# EAGLE design SleepSureStandAloneV2 (EAGLE 9.6.2)
COMPANY: ADAFRUIT INDUSTRIES; DRAWN: KTOWN; REV: B
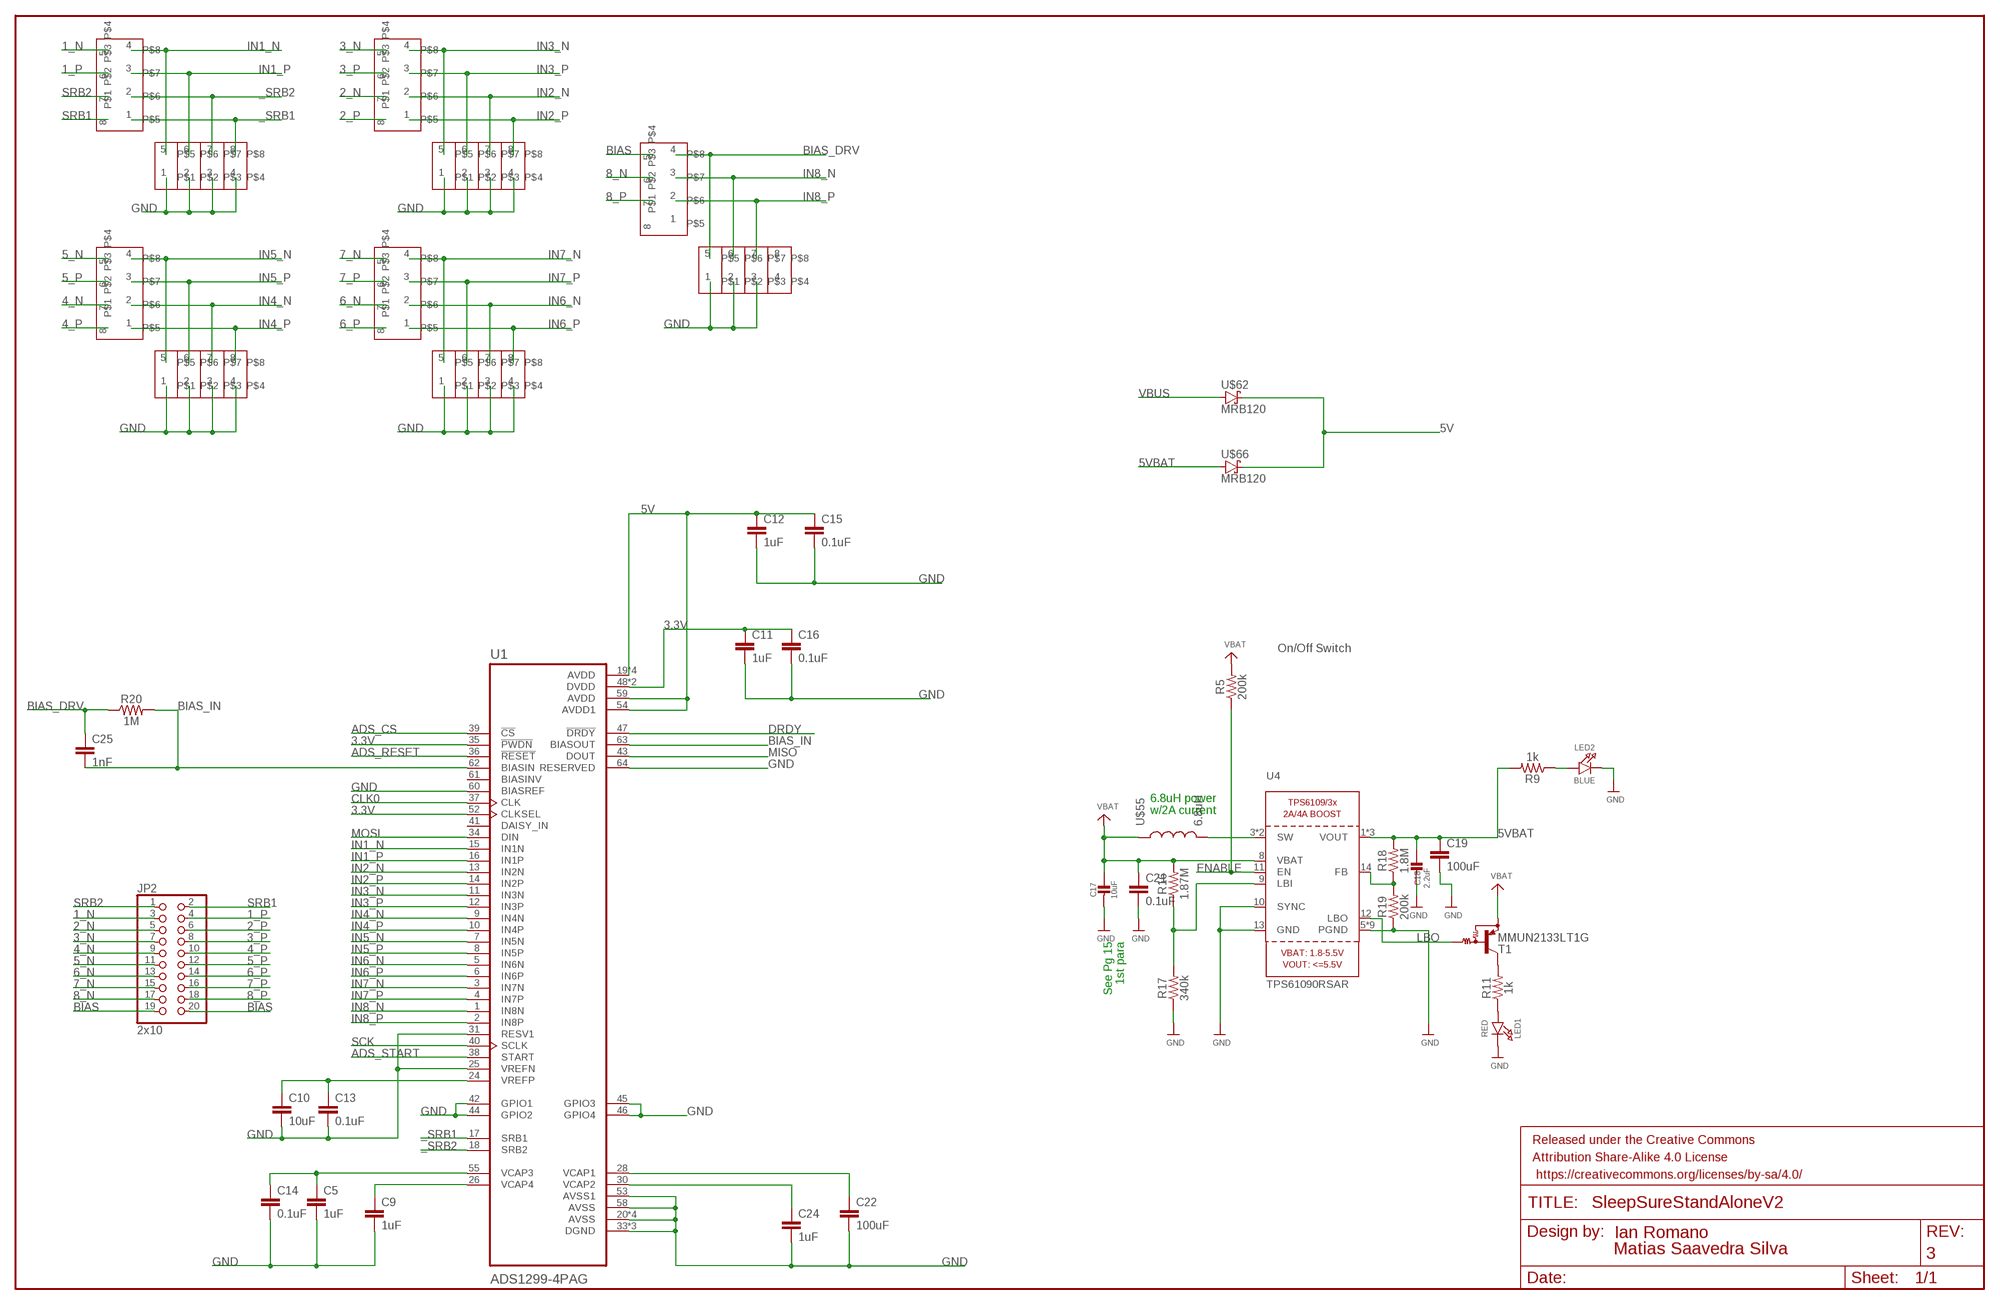
[diagram p0: schematic, sheet 1, part 1 of 2]
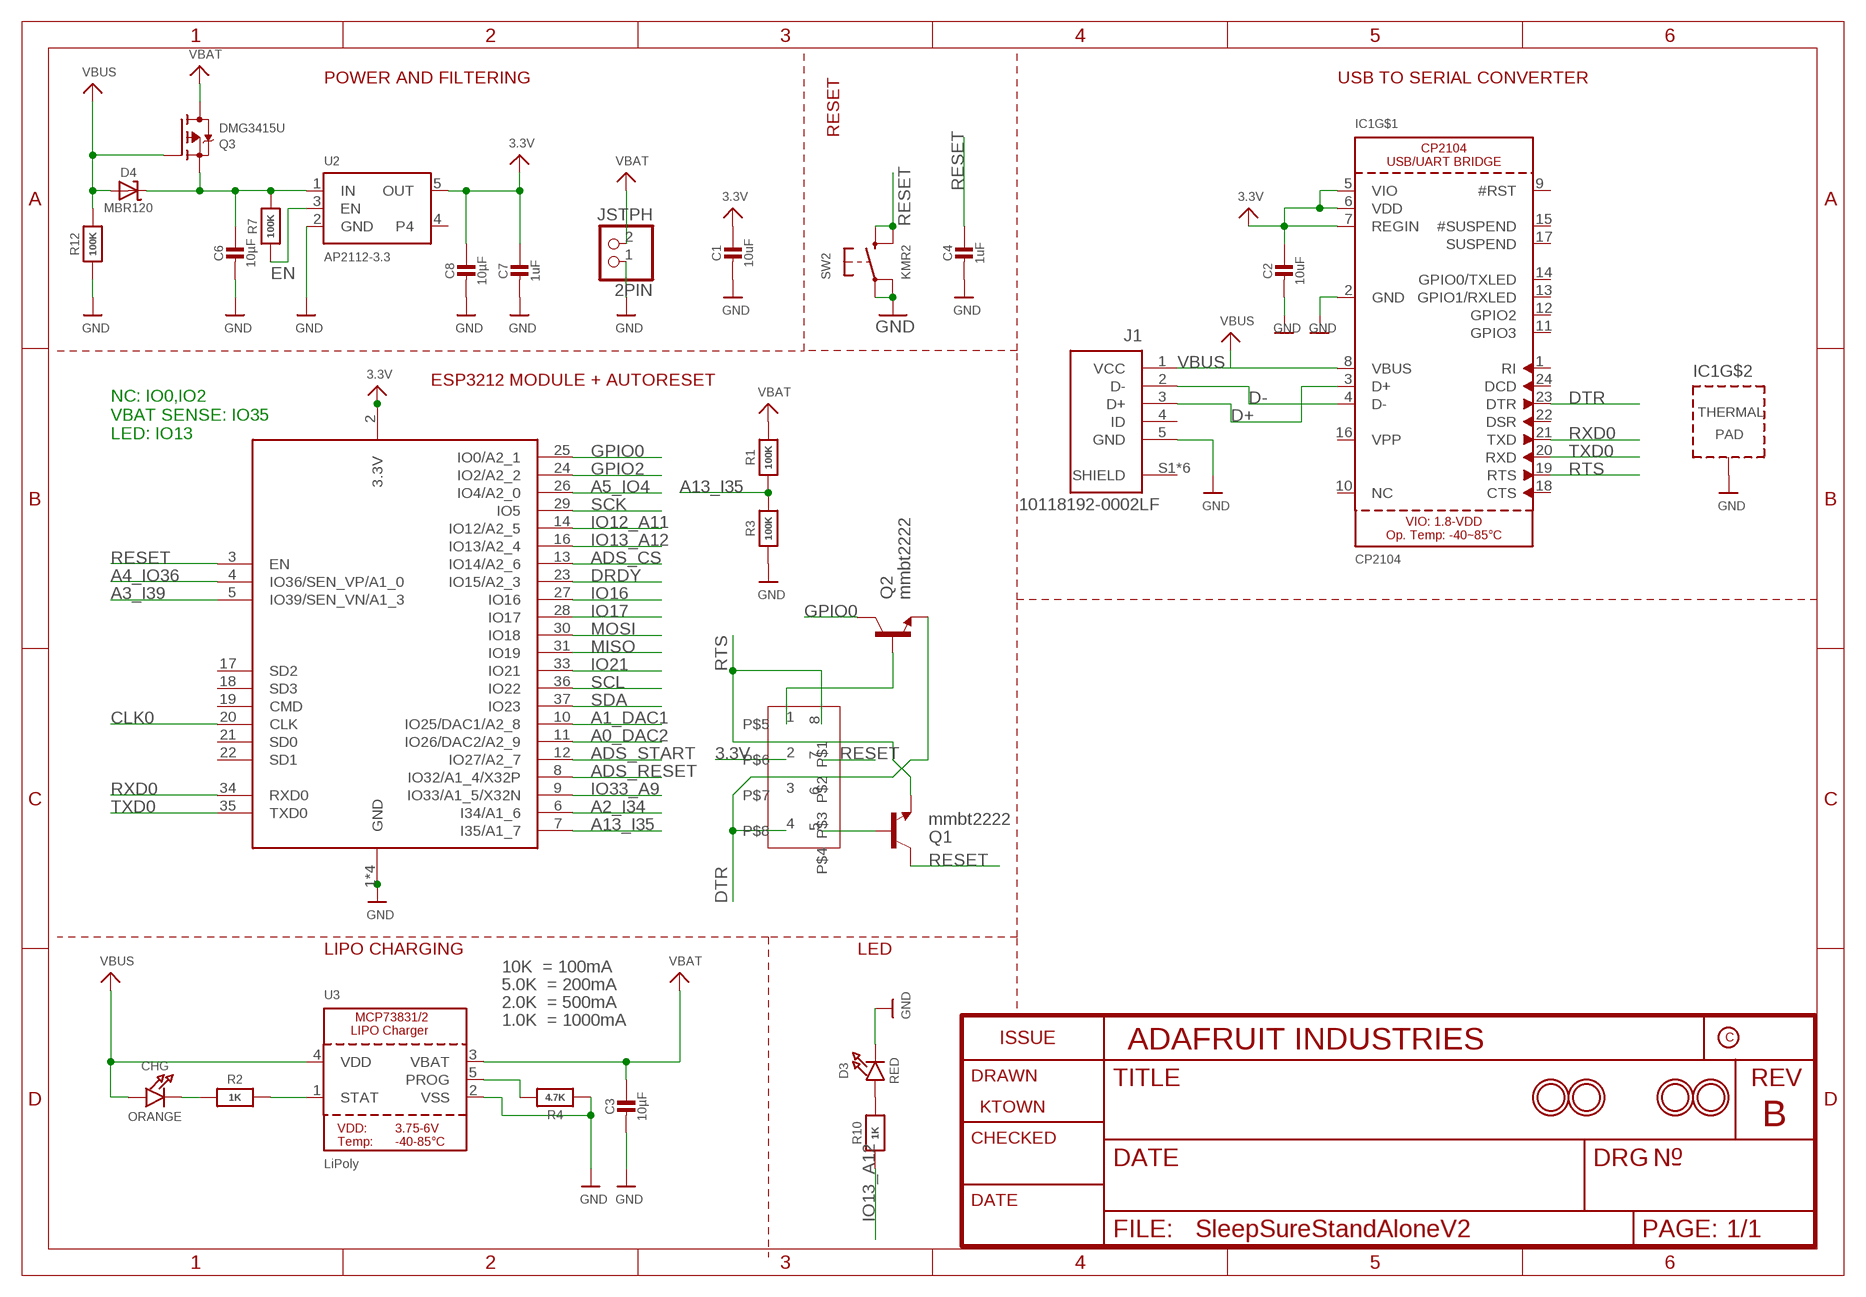
[diagram p1: schematic, sheet 1, part 2 of 2]

## Parts
2PIN  JSTPH  CON_JST_PH_2PIN  [JSTPH2]
C1  10uF  CAP_CERAMIC0805-NOOUTLINE  [0805-NO]
C2  10uF  CAP_CERAMIC0805-NOOUTLINE  [0805-NO]
C3  10µF  CAP_CERAMIC0805-NOOUTLINE  [0805-NO]
C4  1uF  CAP_CERAMIC0603_NO  [0603-NO]
C5  1uF  10UF-0805-10V-10%  [0805]
C6  10µF  CAP_CERAMIC0805-NOOUTLINE  [0805-NO]
C7  1uF  CAP_CERAMIC0603_NO  [0603-NO]
C8  10µF  CAP_CERAMIC0805-NOOUTLINE  [0805-NO]
C9  1uF  10UF-0805-10V-10%  [0805]
C10  10uF  10UF-0805-10V-10%  [0805]
C11  1uF  10UF-0805-10V-10%  [0805]
C12  1uF  10UF-0805-10V-10%  [0805]
C13  0.1uF  10UF-0805-10V-10%  [0805]
C14  0.1uF  10UF-0805-10V-10%  [0805]
C15  0.1uF  10UF-0805-10V-10%  [0805]
C16  0.1uF  10UF-0805-10V-10%  [0805]
C17  10uF  CAP_CERAMIC0805-NOOUTLINE  [0805-NO]
C18  2.2uF  CAP_CERAMIC0805-NOOUTLINE  [0805-NO]
C19  100uF  10UF-1206-6.3V-20%  [1206]
C21  0.1uF  10UF-0805-10V-10%  [0805]
C22  100uF  10UF-1206-6.3V-20%  [1206]
C24  1uF  10UF-0805-10V-10%  [0805]
C25  1nF  10UF-0805-10V-10%  [0805]
CHG  ORANGE  LED0805_NOOUTLINE  [CHIPLED_0805_NOOUTLINE]
D3  RED  LED0805_NOOUTLINE  [CHIPLED_0805_NOOUTLINE]
D4  MBR120  DIODE-SCHOTTKYSOD-123  [SOD-123]
FRAME2  FRAME-LEDGER  [CREATIVE_COMMONS]
IC1  CP2104  [QFN24_4MM_SMSC]
J1  10118192-0002LF  [AMPHENOL_10118192-0002LF]
JP2  2x10  PINHD-2X10-BIG  [2X09-BIG]
LED1  RED  LED0805_NOOUTLINE  [CHIPLED_0805_NOOUTLINE]
LED2  BLUE  LED0805_NOOUTLINE  [CHIPLED_0805_NOOUTLINE]
Q1  mmbt2222  TRANSISTOR_NPNSOT23-3  [SOT23-3]
Q2  mmbt2222  TRANSISTOR_NPNSOT23-3  [SOT23-3]
Q3  DMG3415U  MOSFET-P  [SOT23-R]
R1  100K  RESISTOR_0603_NOOUT  [0603-NO]
R2  1K  RESISTOR_0603_NOOUT  [0603-NO]
R3  100K  RESISTOR_0603_NOOUT  [0603-NO]
R4  4.7K  RESISTOR_0603_NOOUT  [0603-NO]
R5  200k  RESISTOR0805  [0805]
R7  100K  RESISTOR_0603_NOOUT  [0603-NO]
R9  1k  RESISTOR0805  [0805]
R10  1K  RESISTOR_0603_NOOUT  [0603-NO]
R11  1k  RESISTOR0805  [0805]
R12  100K  RESISTOR_0603_NOOUT  [0603-NO]
R16  1.87M  RESISTOR0805  [0805]
R17  340k  RESISTOR0805  [0805]
R18  1.8M  RESISTOR0805  [0805]
R19  200k  RESISTOR0805  [0805]
R20  1M  RESISTOR0805  [0805]
SW2  KMR2  SWITCH_TACT_SMT4.6X2.8  [BTN_KMR2_4.6X2.8]
T1  MMUN2133LT1G  MUN2114T1-PNP_DRIVER-SC59-BEC  [SC59-BEC]
U1  ADS1299-4PAG  [QFP50P1200X1200X120-64N]
U2  AP2112-3.3  VREG_SOT23-5  [SOT23-5]
U3  LiPoly  MCP73831/2  [SOT23-5]
U4  TPS61090RSAR  VREG_TPS6103X  [PVQFN-16]
U$6  MOUNTINGHOLE2.5  [MOUNTINGHOLE_2.5_PLATED]
U$7  10k  EXB-28V222JX  [RESCAXS50P200X100X45-8N]
U$19  MOUNTINGHOLE2.5  [MOUNTINGHOLE_2.5_PLATED]
U$23  1nF  W2A45C103MAT2A  [CAPCAXE50P210X130X94-8N]
U$31  MOUNTINGHOLE2.5  [MOUNTINGHOLE_2.5_PLATED]
U$32  MOUNTINGHOLE2.5  [MOUNTINGHOLE_2.5_PLATED]
U$44  2.2k  EXB-28V222JX  [RESCAXS50P200X100X45-8N]
U$45  2.2k  EXB-28V222JX  [RESCAXS50P200X100X45-8N]
U$46  1nF  W2A45C103MAT2A  [CAPCAXE50P210X130X94-8N]
U$47  2.2k  EXB-28V222JX  [RESCAXS50P200X100X45-8N]
U$48  1nF  W2A45C103MAT2A  [CAPCAXE50P210X130X94-8N]
U$49  2.2k  EXB-28V222JX  [RESCAXS50P200X100X45-8N]
U$50  1nF  W2A45C103MAT2A  [CAPCAXE50P210X130X94-8N]
U$51  2.2k  EXB-28V222JX  [RESCAXS50P200X100X45-8N]
U$52  1nF  W2A45C103MAT2A  [CAPCAXE50P210X130X94-8N]
U$55  6.8uH  ASPI-0628-6R8M-T1  [0628]
U$62  MRB120  MBR160HW  [SOD123FL]
U$66  MRB120  MBR160HW  [SOD123FL]
X2  ESP32_WROOM32_SKINNY  [WROOM32_SKINNY]

## Nets
1_N [DiffPairs]: JP2.3 U$44.5
1_P [DiffPairs]: JP2.4 U$44.6
2_N [DiffPairs]: JP2.5 U$45.7
2_P [DiffPairs]: JP2.6 U$45.8
3.3V [PWR]: C1.1 C2.1 C7.1 C8.1 C11.1 C16.1 IC1.5(VIO) IC1.6(VDD) IC1.7(REGIN) U1.35(!PWDN) U1.48(DVDD) U1.50(DVDD) U1.52(CLKSEL) U2.5(OUT) U$7.2 X2.2(3.3V)
3_N [DiffPairs]: JP2.7 U$45.5
3_P [DiffPairs]: JP2.8 U$45.6
4_N [DiffPairs]: JP2.9 U$47.7
4_P [DiffPairs]: JP2.10 U$47.8
5_N: JP2.11 U$47.5
5_P: JP2.12 U$47.6
5V: C12.1 C15.1 U1.19(AVDD) U1.21(AVDD) U1.22(AVDD) U1.54(AVDD1) U1.56(AVDD) U1.59(AVDD) U$62.C U$66.C
5VBAT: C18.1 C19.1 R9.2 R18.2 U4.1(VOUT) U4.15(VOUT) U4.16(VOUT) U$66.A
6_N: JP2.13 U$49.7
6_P: JP2.14 U$49.8
7_N: JP2.15 U$49.5
7_P: JP2.16 U$49.6
8_N [PWR]: JP2.17 U$51.6
8_P [PWR]: JP2.18 U$51.7
_SRB1: U1.17(SRB1) U$23.8 U$44.1
_SRB2: U1.18(SRB2) U$23.7 U$44.2
A0_DAC2: X2.11(IO26/DAC2/A2_9)
A1_DAC1: X2.10(IO25/DAC1/A2_8)
A2_I34: X2.6(I34/A1_6)
A3_I39: X2.5(IO39/SEN_VN/A1_3)
A4_IO36: X2.4(IO36/SEN_VP/A1_0)
A5_IO4: X2.26(IO4/A2_0)
A13_I35: R1.1 R3.2 X2.7(I35/A1_7)
ADS_CS: U1.39(!CS) X2.13(IO14/A2_6)
ADS_RESET: U1.36(!RESET) X2.8(IO32/A1_4/X32P)
ADS_START: U1.38(START) X2.12(IO27/A2_7)
BIAS: JP2.19 JP2.20 U$51.5
BIAS_DRV: C25.1 R20.1 U$51.4 U$52.5
BIAS_IN: C25.2 R20.2 U1.62(BIASIN) U1.63(BIASOUT)
CLK0: U1.37(CLK) X2.20(CLK)
D+: IC1.3(D+) J1.3(D+)
D-: IC1.4(D-) J1.2(D-)
DRDY: U1.47(!DRDY) X2.23(IO15/A2_3)
DTR: IC1.23(DTR) Q2.2(E) U$7.4
EN: R7.1 U2.3(EN)
ENABLE: R5.1 U4.11(EN)
GND [PWR]: 2PIN.1 C1.2 C2.2 C3.2 C4.2 C5.2 C6.2 C7.2 C8.2 C9.2 C10.2 C11.2 C12.2 C13.2 C14.2 C15.2 C16.2 C17.2 C18.2 C19.2 C21.2 C22.2 C24.2 D3.C IC1.2(GND) IC1.THERM(TP) J1.5(GND) LED1.C LED2.C R3.1 R4.1 R12.1 R17.1 R19.1 SW2.A'(P1) SW2.A(P) U1.20(AVSS) U1.23(AVSS) U1.25(VREFN) U1.31(RESV1) U1.32(AVSS) U1.33(DGND) U1.42(GPIO1) U1.44(GPIO2) U1.45(GPIO3) U1.46(GPIO4) U1.49(DGND) U1.51(DGND) U1.53(AVSS1) U1.57(AVSS) U1.58(AVSS) U1.60(BIASREF) U1.64(RESERVED) U2.2(GND) U3.2(VSS) U4.5(PGND) U4.6(PGND) U4.7(PGND) U4.10(SYNC) U4.13(GND) U4.P$18(PGND) U4.P$19(PGND) U4.P$20(PGND) U4.P$21(PGND) U4.P$22(PGND) U4.THERMAL(PGND) U$23.1 U$23.2 U$23.3 U$23.4 U$46.1 U$46.2 U$46.3 U$46.4 U$48.1 U$48.2 U$48.3 U$48.4 U$50.1 U$50.2 U$50.3 U$50.4 U$52.1 U$52.2 U$52.3 X2.1(GND) X2.15(GND) X2.38(GND) X2.P$1(GND)
GPIO0: Q2.3(C) X2.25(IO0/A2_1)
GPIO2: X2.24(IO2/A2_2)
IN1_N [DiffPairs]: U1.15(IN1N) U$23.5 U$44.4
IN1_P [DiffPairs]: U1.16(IN1P) U$23.6 U$44.3
IN2_N [DiffPairs]: U1.13(IN2N) U$45.2 U$46.7
IN2_P [DiffPairs]: U1.14(IN2P) U$45.1 U$46.8
IN3_N [DiffPairs]: U1.11(IN3N) U$45.4 U$46.5
IN3_P [DiffPairs]: U1.12(IN3P) U$45.3 U$46.6
IN4_N [DiffPairs]: U1.9(IN4N) U$47.2 U$48.7
IN4_P [DiffPairs]: U1.10(IN4P) U$47.1 U$48.8
IN5_N [PWR]: U1.7(IN5N) U$47.4 U$48.5
IN5_P [PWR]: U1.8(IN5P) U$47.3 U$48.6
IN6_N [PWR]: U1.5(IN6N) U$49.2 U$50.7
IN6_P [PWR]: U1.6(IN6P) U$49.1 U$50.8
IN7_N [PWR]: U1.3(IN7N) U$49.4 U$50.5
IN7_P [PWR]: U1.4(IN7P) U$49.3 U$50.6
IN8_N [PWR]: U1.1(IN8N) U$51.3 U$52.6
IN8_P [PWR]: U1.2(IN8P) U$51.2 U$52.7
IO12_A11: X2.14(IO12/A2_5)
IO13_A12: R10.1 X2.16(IO13/A2_4)
IO16: X2.27(IO16)
IO17: X2.28(IO17)
IO21: X2.33(IO21)
IO33_A9: X2.9(IO33/A1_5/X32N)
LBO: T1.B U4.12(LBO)
MISO: U1.43(DOUT) X2.31(IO19)
MOSI: U1.34(DIN) X2.30(IO18)
N$1: CHG.C R2.1
N$2: Q2.1(B) U$7.1
N$3: R2.2 U3.1(STAT)
N$4: R4.2 U3.5(PROG)
N$5: D3.A R10.2
N$6: Q1.1(B) U$7.5
N$7: C6.1 D4.C Q3.2(S) R7.2 U2.1(IN)
N$8: C24.1 U1.30(VCAP2)
N$9: C22.1 U1.28(VCAP1)
N$10: C10.1 C13.1 U1.24(VREFP)
N$11: C5.1 C14.1 U1.55(VCAP3)
N$14: C9.1 U1.26(VCAP4)
N$16: U4.3(SW) U4.4(SW) U$55.P$2
N$17: R16.1 R17.2 U4.9(LBI)
N$18: R18.1 R19.2 U4.14(FB)
N$19: LED2.A R9.1
N$20: LED1.A R11.1
N$21: R11.2 T1.C
RESET: C4.1 Q1.3(C) SW2.B'(S1) SW2.B(S) U$7.7 X2.3(EN)
RTS: IC1.19(RTS) Q1.2(E) U$7.8
RXD0: IC1.21(TXD) X2.34(RXD0)
SCK: U1.40(SCLK) X2.29(IO5)
SCL: X2.36(IO22)
SDA: X2.37(IO23)
SRB1: JP2.2 U$44.8
SRB2: JP2.1 U$44.7
TXD0: IC1.20(RXD) X2.35(TXD0)
VBAT: 2PIN.2 C3.1 C17.1 C21.1 Q3.3(D) R1.2 R5.2 R16.2 T1.E U3.3(VBAT) U4.8(VBAT) U$55.P$1
VBUS: CHG.A D4.A IC1.8(VBUS) J1.1(VCC) Q3.1(G) R12.2 U3.4(VDD) U$62.A
Unconnected: IC1.1(RI) IC1.9(#RST) IC1.10(NC) IC1.11(GPIO3) IC1.12(GPIO2) IC1.13(GPIO1/RXLED) IC1.14(GPIO0/TXLED) IC1.15(#SUSPEND) IC1.16(VPP) IC1.17(SUSPEND) IC1.18(CTS) IC1.22(DSR) IC1.24(DCD) J1.4(ID) J1.S1(SHIELD) J1.S2(SHIELD) J1.S3(SHIELD) J1.S4(SHIELD) J1.S5(SHIELD) J1.S6(SHIELD) U1.41(DAISY_IN) U1.61(BIASINV) U2.4 U$7.3 U$7.6 U$51.1 U$51.8 U$52.4 U$52.8 X2.17(SD2) X2.18(SD3) X2.19(CMD) X2.21(SD0) X2.22(SD1)

## Notes on the sheet
- POWER AND FILTERING | USB TO SERIAL CONVERTER
- RESET
- On/Off Switch
- ESP3212 MODULE + AUTORESET
- NC: IO0,IO2
  VBAT SENSE: IO35
  LED: IO13
- 6.8uH power
  w/2A current
- See Pg 15
  1st para
- LIPO CHARGING | LED
- 10K  = 100mA
- 5.0K  = 200mA
- 2.0K  = 500mA
- 1.0K  = 1000mA

## Library data of the parts
2PIN = microbuilder:CON_JST_PH_2PIN: JST 2-Pin Right-Angle Connector PH-Series - 4UConnector: 17311 SH-Series - 4UConnector: 07278
C1-C4 C6-C8 C17 C18 = microbuilder:CAP_CERAMIC: Ceramic Capacitors For new designs, use the packages preceded by an '_' character since they are more reliable: The following footprints should be used on most boards: _0402 - Standard footprint for regular board layouts _0603 - Standard footprint for regular board layouts _0805 - Standard footprint for regular board layouts _1206 - Standard footprint for regular board layouts For extremely tight-pitch boards where space is at a premium, the following 'micro-pitch' footprints can be used (smaller pads, no silkscreen outline, etc.): _0402MP - Micro-pitch footprint for very dense/compact boards _0603MP - Micro-pitch footprint for very dense/compact boards _0805MP - Micro-pitch footprint for very dense/compact boards _1206MP - Micro-pitch footprint for very dense/compact boards
C5 C9 C11-C16 C21 C24 C25 = SparkFun-Capacitors:10UF: 10.0µF ceramic capacitors A capacitor is a passive two-terminal electrical component used to store electrical energy temporarily in an electric field.; PROD_ID: CAP-11330; VALUE: 10uF
C10 = SparkFun-Capacitors:10UF: 10.0µF ceramic capacitors A capacitor is a passive two-terminal electrical component used to store electrical energy temporarily in an electric field.; PROD_ID: CAP-11330
C19 C22 = SparkFun-Capacitors:10UF: 10.0µF ceramic capacitors A capacitor is a passive two-terminal electrical component used to store electrical energy temporarily in an electric field.; PROD_ID: CAP-10057; VALUE: 10uF
CHG D3 LED1 LED2 = microbuilder:LED: LED 0603 - 0603 Surface Mount Package 2mA: Green LED - Low Power (3.9mcd, 2ma, 1.7Vf) - Digikey: 475-2709-2-ND Orange LED - Low Power (9.8mcd, 2ma, 1.8Vf) - Digikey: 475-1194-2-ND Red LED - Low Power (5mcd, 2ma, 1.8Vf) - Digikey: 475-1195-2-ND Yellow LED - Low Power (7mcd, 2ma, 1.8Vf) - Digikey: 475-1196-2-ND 5mA: Blue LED - Low Power (17mcd, 5ma, 2.9Vf) - Digikey: LNJ937W8CRACT-ND 0805 - 0805 Surface Mount Package 2mA: Red LED (8.8mcd, 2mA, 1.8Vf, Clear) - Low Power [Digikey: 475-2510-1-ND] Green LED (5mcd, 2mA, 1.8Vf, Clear) - Low Power [Digikey: 475-2730-1-ND] Yellow LED (11.3mcd, 2mA, 1.8Vf, Clear) - Low Power [Digikey: 475-2555-1-ND] 20mA: Red LED (104mcd, 20mA, Diffused) - LS R976 [Digikey: 475-1278-6-ND] Red LED (12mcd, 20mA, 2.0Vf, Clear) - APT2012EC [Digikey: 754-1128-1-ND] Green LED (15mcd, 20mA, 2.2Vf, Clear) - APT2012GC [Digikey: 754-1131-1-ND] Orange LED (160mcd, 20mA, 2.1Vf, Clear) - APT2012SECK [Digikey: 754-1130-1-ND] 1206 - 1206 Surface Mount Package Green LED (26mcd, 20mA, Diffused) - LG N971 [Digikey: 475-1407-6-ND] Red LED (15mcd, 20mA, Diffused) - LH N974 [Digikey: 475-1416-6-ND] Cree - Cree High-Power Surface Mount LEDs XPEBWT-L1-0000-00D50 - White 111lm 350mA 2.9Vf 6200K 110° XTEAWT-00-0000-00000LEE3 - White 114lm 350mA 2.85Vf 5000K 115° Everlight - Everlight 45-21 Series Surface Mount LEDs 45-21/QK2C-B2832AC2CB2/2T - Warm White 2000mcd 20mA 3.25Vf 3050K 120° 45-21/LK2C-B38452C4CB2/2T - Nuetral White 2000mcd 20mA 3.25Vf 4150K 120° 45-21/LK2C-B50634C6CB2/2T - Cold White 2200mcd 20mA 3.25Vf 5650K 120° PLCC2 Reverse Mount LS T77K-J1L2-1-0-2-R18-Z - Red 11.25mcd 2mA 1.8Vf 630nm 120° LO T77K-L1M2-24-Z - Orange 19.6mcd 2mA 1.8Vf 606nm 120° LY T77K-K2M1-26-Z - Yellow 15.7mcd 2mA 1.8Vf 587nm 120°
D4 = microbuilder:DIODE-SCHOTTKY
FRAME2 = SparkFun-Aesthetics:FRAME-LEDGER: Schematic Frame - Ledger Standard 11x14 US Ledger frame; DESIGNER: Ian Romano; DESIGNER2: Matias Saavedra Silva; REV: 3
IC1 = microbuilder:CP2104: CP2104 - USB to UART Bridge VDD Output: 3.45V
J1 = ADS_Feather:10118192-0002LF: USB - micro B USB 2.0 Receptacle Connector 5 Position Surface Mount, Right Angle Check prices <https://pricing.snapeda.com/parts/10118192-0002LF/Amphenol%20ICC%20%28FCI%29/view-part?ref=eda>; AVAILABILITY: Good; DESCRIPTION: USB - micro B USB 2.0 Receptacle Connector 5 Position Surface Mount, Right Angle; MF: Amphenol ICC (FCI); MP: 10118192-0002LF; PACKAGE: None; PRICE: None; PURCHASE-URL: https://pricing.snapeda.com/search/part/10118192-0002LF/?ref=eda
JP2 = SleepSureLib:PINHD-2X10: PIN HEADER With larger annulars
Q1 Q2 = SparkFun:TRANSISTOR_NPN: Transistor NPN BJT configuration in SOT23 package. MMBT2222 is the common NPN we use. Double check BCE configuration again layout.
Q3 = microbuilder:MOSFET-P: P-Channel Mosfet LEGEND VDS: Voltage Drain-Source ID: Drain Current RDS(ON): Drain-Source On-State Resistance VGS(TH): Gate-Source Threshold Voltage CISS: Drain-Source Input Capacitance SOT-23 Name VDS ID RDS(ON) VGS(TH) CISS Order Number IRLML5103 30V 760mA 600 mOhm -- 75pF @ 25V Digikey: IRLML5103PBFCT-ND IRLML6401 12V 4.3A 50 mOhm 950mV @ 250µA 830pF @ 10V Digikey: IRLML6401PBFTR-ND NTR0202PL 20V 400mA 800 mOhm 2.3V @ 250uA 70pF @ 5V Digikey: NTR0202PLT1GOSTR-ND NTR4101PT1G 20V 1.8A 85 mOhm 1.2V @ 250uA 675pF @ 10V Digikey: NTR4101PT1GOSCT-ND DMP2004K 20V 600mA 900 mOhm 1V @ 250uA 175pF @ 16V Digikey: DMP2004KDICT-ND PMV65XP 20V 3.9A 76 mOhm 950mV @ 1mA 725pF @ 20V Digikey: 568-2358-2-ND TO-252 Name VDS ID RDS(ON) VGS(TH) CISS Order Number AOD417 30V 25A 34 mOhm 3V @ 250µA 920pF @ 15V Digikey: 785-1106-2-ND PowerPak Name VDS ID RDS(ON) VGS(TH) CISS Order Number AON7401 30V 12A 14 mOhm 3V @ 250µA 2600pF @ 15V Digikey: 785-1302-1-ND
R1-R4 R7 R10 R12 = microbuilder:RESISTOR: Resistors For new designs, use the packages preceded by an '_' character since they are more reliable: The following footprints should be used on most boards: _0402 - Standard footprint for regular board layouts _0603 - Standard footprint for regular board layouts _0805 - Standard footprint for regular board layouts _1206 - Standard footprint for regular board layouts For extremely tight-pitch boards where space is at a premium, the following 'micro-pitch' footprints can be used (smaller pads, no silkscreen outline, etc.): _0402MP - Micro-pitch footprint for very dense/compact boards _0603MP - Micro-pitch footprint for very dense/compact boards _0805MP - Micro-pitch footprint for very dense/compact boards _1206MP - Micro-pitch footprint for very dense/compact boards
R5 R9 R11 R16-R20 = SparkFun-Resistors:RESISTOR: Generic Resistor Package
SW2 = microbuilder:SWITCH_TACT_SMT: SMT Tact Switches 6x6mm - Digikey: P12940SCT-ND KMR2 (4.6x2.8mm) - Digikey: 401-1426-1-ND EVQ-PQHB55 - Light Touch, 160GF (4.5x4.5mm) - Digikey: P8090SCT-ND KMT0 - KMT021 NGJ LHS (etc.) IP68/Waterproof - Digikey: CKN10289CT-ND
T1 = transistor:*-PNP_DRIVER-: PNP Bias Resistor Transistor
U1 = ADS1299-4PAG:ADS1299-4PAG: Check prices <https://pricing.snapeda.com/search/part/ADS1299-4PAG/?ref=eda>; AVAILABILITY: Warning; DESCRIPTION: Low-Noise, 4-Channel, 24-Bit Analog-to-Digital Converter for Biopotential Measurements 64-TQFP -40 to 85; MF: Texas Instruments; MP: ADS1299-4PAG; PACKAGE: TQFP-64 Texas Instruments; PRICE: None; PURCHASE-URL: https://pricing.snapeda.com/search/part/ADS1299-4PAG/?ref=eda
U2 = microbuilder:VREG_SOT23-5: SOT23-5 Fixed Voltage Regulators Part Current Out V Out V In V Dropout θJA (°C/W) TJ (°C) Digikey Part No. ADP121 150mA 3.3V 3.4-5.5V 0.09V @ 150mA -- -- ADP121-AUJZ33R7CT-ND ADP121 150mA 3.0V 3.1-5.5V 0.09V @ 150mA -- -- ADP121-AUJZ30R7CT-ND ADP122 300mA 3.3V 3.4-5.5V 0.085V @ 300mA -- -- ADP122AUJZ-3.3-R7CT-ND ADP1712 300mA 3.3V 3.5-5.5V 0.17V @ 300mA -- -- ADP1712AUJZ-3.3-R7TR-ND AP7311 (Low Cost) 150mA 3.3V 3.5-6V 0.15V @ 150mA -- -- AP7311-33WG-7DICT-ND LD39015M18R 150mA 1.8V 1.9V-5.5V 0.08V @ 100mA -- -- 497-6977-1-ND LP2985A-33DBVR 150mA 3.3V 3.3-16V 0.28V @ 150mA 206 150 296-18479-1-ND MCP1824T-3302E/OT 300mA 3.3V 3.5V-6V 0.2V @ 300mA -- -- MCP1824T-3302E/OTCT-ND MIC5205-2.5YM5 TR 150mA 2.5V 2.7-16V 0.165V @ 150mA -- -- 576-1257-2-ND MIC5205-3.0YM5 TR 150mA 3.0V 3.2V-16V 0.165V @ 150mA -- -- 576-1258-2-ND MIC5205-3.3YM5 TR 150mA 3.3V 3.5V-16V 0.165V @ 150mA -- -- 576-1259-2-ND TPS780330220 150mA 3.3V+2.2V 3.6-5.5V 250mV Max -- -- 296-23332-1-ND TDA3663/N1,135 100mA 3.3V 3.5-45V 0.18V @ 50mA -- -- 568-5343-1-ND Max operating temp can be calculated using θJA, TJ (max junction temperature), and power in watts. Set the "Maximum Ambient Temperature" until it reaches TJ ("Max Junction Temperature"), which is the absolute limit for safe use of the regulator: Heat Sink Temperature Calculator <http://www.daycounter.com/Calculators/Heat-Sink-Temperature-Calculator.phtml> For example, With 12V source into a 3.3V LP2985 and a 30mA load, we are dissipating (12V-3.3V) * 0.03A = 0.261W. With a θJA of 206 °C/W, a TJ of 150°C, and 261mW we can safely use the chip without a heat sink up to 75°C (=147.1°C Junction Temperature).
U3 = microbuilder:MCP73831/2: MCP73831/2 LIPO Charger VDD: 3.75 - 6V Temp -40 - 85°C Programmable Charge Rate: 15-500mA NOTE: STAT is a tri-state logic output on the MCP73831 and an open-drain output on the MCP73832. SOT23-5 with 4.2V output and tri-state logic on STAT = MCP73831T-2ACI/OT
U4 = microbuilder:VREG_TPS6103X: TPS6103x 4A Boost - 1.8-5.5V Input, Adjustable Output to 5.5V
U$6 U$19 U$31 U$32 = microbuilder:MOUNTINGHOLE: Mounting Hole For #2 screws (0.086"/2.18mm width, 0.094"/2.4mm hole) use 2.5mm; BOM: EXCLUDE
U$7 U$44 U$45 U$47 U$49 U$51 = SleepSureLib:EXB-28V222JX: 2.2k 4x Resistor Array
U$23 U$46 U$48 U$50 U$52 = SleepSureLib:W2A45C103MAT2A: 4x 1nF Capacitor Array
U$55 = ADS_Feather:ASPI-0628-6R8M-T1: ASPI-0628 Inductor Based on Abracon Corp ASPI-0628 inductor: datasheet <https://abracon.com/Magnetics/new/ASPI-0628.pdf>.
U$62 U$66 = ADS_Feather:MBR160HW: MBR160HW SCHOTTKY BARRIER DIODE Based on SMC MBR160HW SCHOTTKY BARRIER DIODE: datasheet <http://www.smc-diodes.com/propdf/MBR160HW%20N0933%20REV.B.pdf>.
X2 = microbuilder:ESP32_WROOM32

## Net classes
0 default: width 0.152 mm, drill 0.305 mm, clearance 0.152 mm
1 DiffPairs: width 0.152 mm, drill 0.305 mm, clearance 0.152 mm
2 PWR: width 0.203 mm, drill 0.305 mm, clearance 0.203 mm

## Board
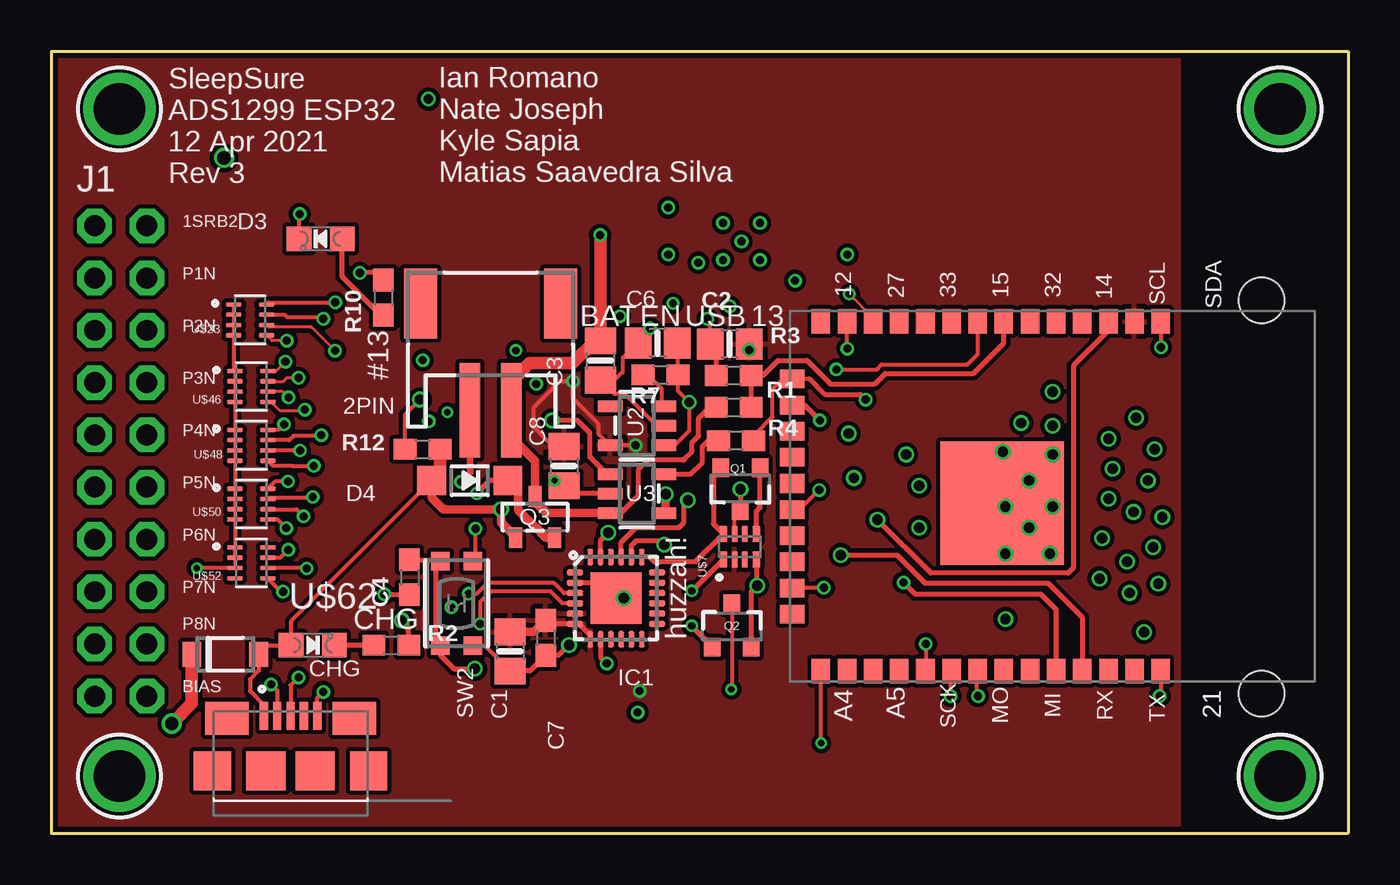
[diagram p2: board, top side]
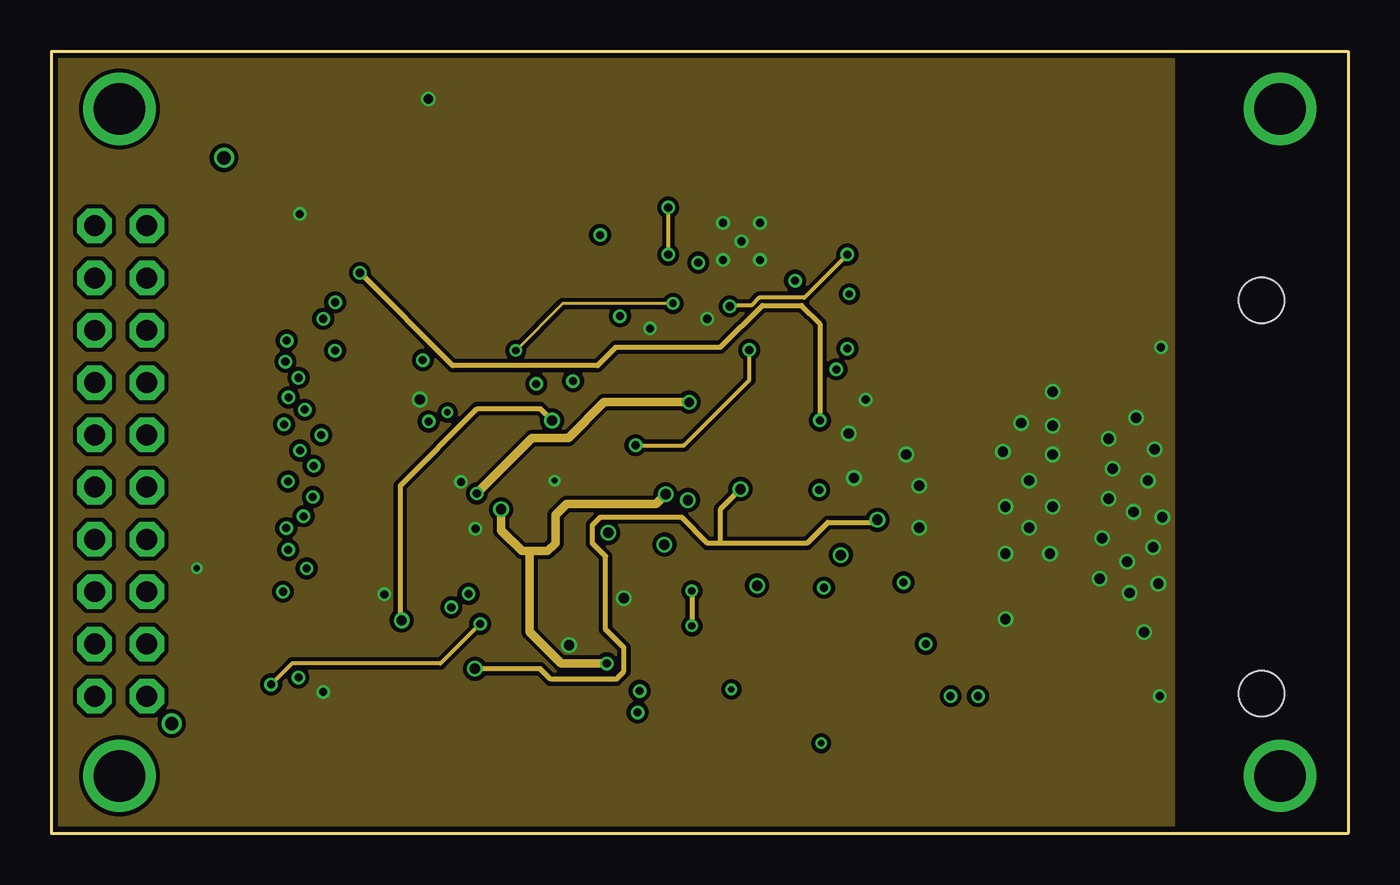
[diagram p3: board, inner layer Route2]
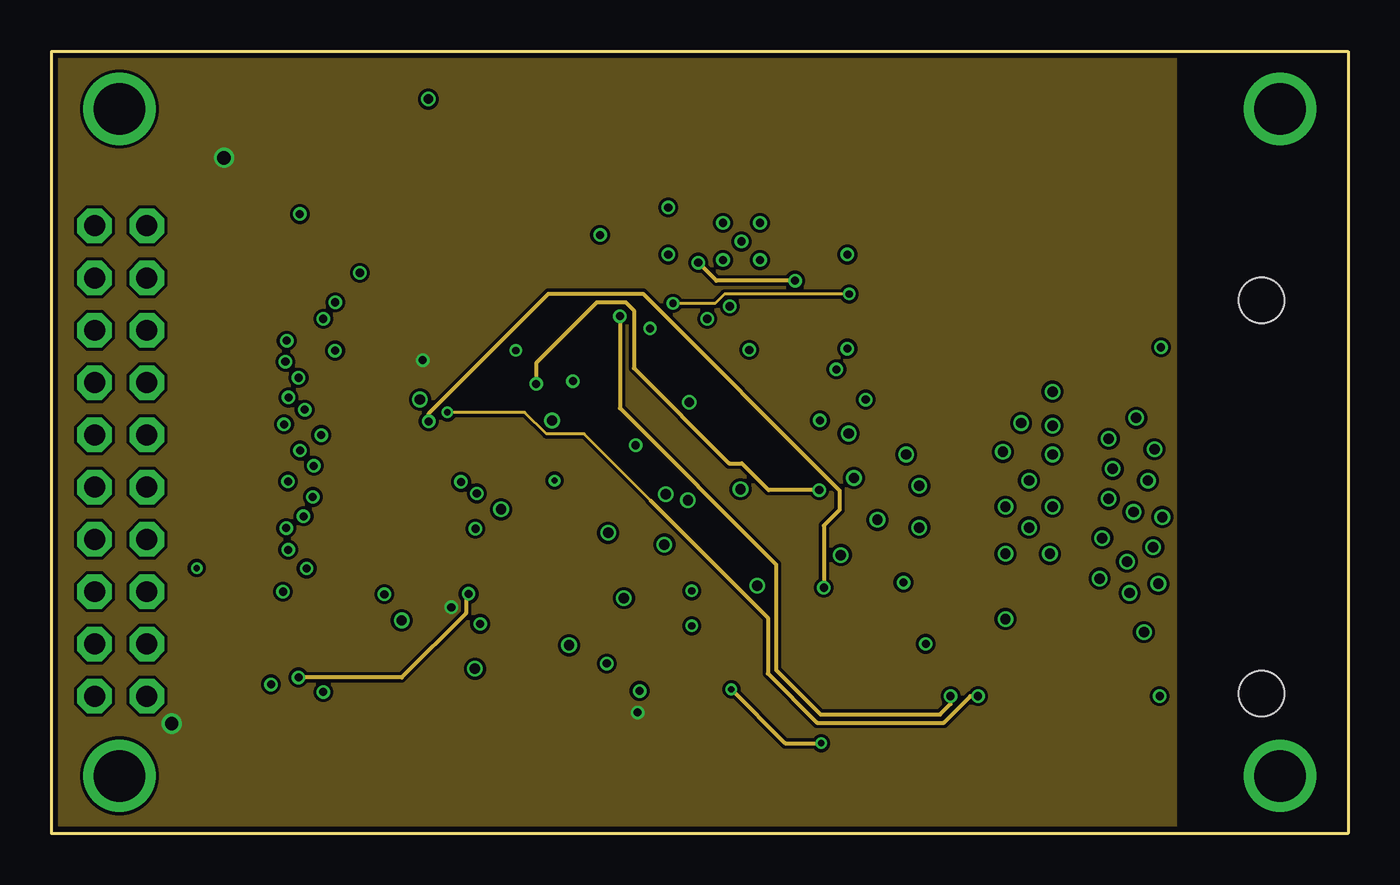
[diagram p4: board, inner layer Route15]
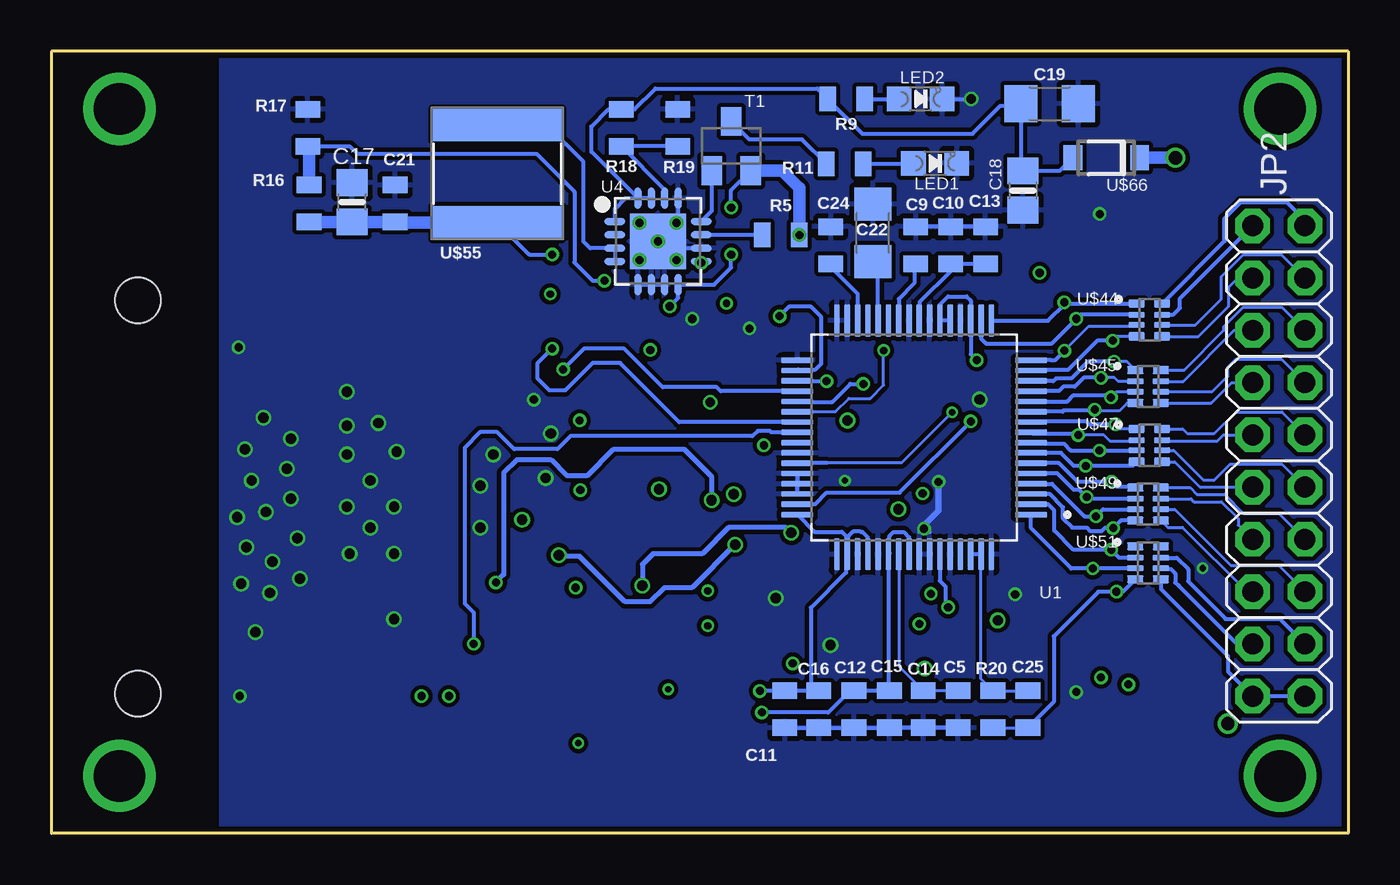
[diagram p5: board, bottom side, seen from below]

Size 63 x 38 mm. Coordinates in mm from the lower left corner, seen from the top.
Outline: 0,38 63,38 63,0 0,0 0,38
Copper layers (1+2*15+16): Top 0.035mm / dielectric 1.5mm / Route2 0.017mm / dielectric 0.15mm / Route15 0.017mm / dielectric 0.2mm / Bottom 0.035mm
Design rules "jplpcb_4layer": minimum track width 5mil, minimum drill 0.2mm, track to track 5mil, track to pad 0.2mm, pad to pad 5mil, via to via 5mil, smd to smd 0mil, copper to edge 10mil, drill to drill 8mil, minimum pad ring 0.13mm, minimum via ring 0.13mm, stop-mask expansion 0.00126875mm, vias tented up to drill 20mil, thermal gap 10mil
Holes 2.2 mm at 58.8,6.79 58.8,25.91

### Footprints (pad centres in the part's own frame; a part is rotated, then mirrored left to right if it is on the bottom)
JSTPH2 = smd 1 x 4.6: 1 -1,-3.7; 2 1,-3.7 | smd 1.6 x 3.4: NC1 -3.4,1.5; NC2 3.4,1.5
0805-NO = smd 1.3 x 1.5: 1 -0.95,0; 2 0.95,0
0603-NO = smd 1.1 x 1: 1 -0.85,0; 2 0.85,0
0805 = smd 0.8 x 1.2: 1 -0.9,0; 2 0.9,0
1206 = smd 1.6 x 1.8: 1 -1.4,0; 2 1.4,0
CHIPLED_0805_NOOUTLINE = smd 1.2 x 1.2: A 0,-1.05; C 0,1.05
SOD-123 = smd 1.4 x 1.4: A 1.85,0; C -1.85,0
QFN24_4MM_SMSC = smd 0.8 x 0.28: 1 -2,1.25; 2 -2,0.75; 3 -2,0.25; 4 -2,-0.25; 5 -2,-0.75; 6 -2,-1.25; 13 2,-1.25; 14 2,-0.75; 15 2,-0.25; 16 2,0.25; 17 2,0.75; 18 2,1.25 | smd 0.28 x 0.8: 7 -1.25,-2; 8 -0.75,-2; 9 -0.25,-2; 10 0.25,-2; 11 0.75,-2; 12 1.25,-2; 19 1.25,2; 20 0.75,2; 21 0.25,2; 22 -0.25,2; 23 -0.75,2; 24 -1.25,2 | smd 2.5 x 2.5: THERM 0,0
AMPHENOL_10118192-0002LF = smd 0.4 x 1.35: 1 -1.3,0; 2 -0.65,0; 3 0,0; 4 0.65,0; 5 1.3,0 | smd 2.1 x 1.6: S1 -3.1,-0.125; S2 3.1,-0.125 | smd 1.8 x 1.9: S3 -3.8,-2.675; S6 3.8,-2.675 | smd 1.9 x 1.9: S4 -1.2,-2.675; S5 1.2,-2.675
2X09-BIG = drill 1.016 pad 1.676 octagon: 1 -10.16,-1.27; 2 -10.16,1.27; 3 -7.62,-1.27; 4 -7.62,1.27; 5 -5.08,-1.27; 6 -5.08,1.27; 7 -2.54,-1.27; 8 -2.54,1.27; 9 0,-1.27; 10 0,1.27; 11 2.54,-1.27; 12 2.54,1.27; 13 5.08,-1.27; 14 5.08,1.27; 15 7.62,-1.27; 16 7.62,1.27; 17 10.16,-1.27; 18 10.16,1.27; 19 12.7,-1.27; 20 12.7,1.27
SOT23-3 = smd 0.8 x 0.9: 1 -0.95,-1; 2 0.95,-1; 3 0,1.1
SOT23-R = smd 0.635 x 1.016: 1 -0.95,-1; 2 0.95,-1; 3 0,1
BTN_KMR2_4.6X2.8 = smd 0.9 x 0.9: A 2.05,0.8; A' -2.05,0.8; B 2.05,-0.8; B' -2.05,-0.8
SC59-BEC = smd 1 x 1.4: B -0.95,-1.2; C 0,1.2; E 0.95,-1.2
QFP50P1200X1200X120-64N = smd 1.56 x 0.28: 1 -5.68,3.75; 2 -5.68,3.25; 3 -5.68,2.75; 4 -5.68,2.25; 5 -5.68,1.75; 6 -5.68,1.25; 7 -5.68,0.75; 8 -5.68,0.25; 9 -5.68,-0.25; 10 -5.68,-0.75; 11 -5.68,-1.25; 12 -5.68,-1.75; 13 -5.68,-2.25; 14 -5.68,-2.75; 15 -5.68,-3.25; 16 -5.68,-3.75; 33 5.68,-3.75; 34 5.68,-3.25; 35 5.68,-2.75; 36 5.68,-2.25; 37 5.68,-1.75; 38 5.68,-1.25; 39 5.68,-0.75; 40 5.68,-0.25; 41 5.68,0.25; 42 5.68,0.75; 43 5.68,1.25; 44 5.68,1.75; 45 5.68,2.25; 46 5.68,2.75; 47 5.68,3.25; 48 5.68,3.75 | smd 0.28 x 1.56: 17 -3.75,-5.68; 18 -3.25,-5.68; 19 -2.75,-5.68; 20 -2.25,-5.68; 21 -1.75,-5.68; 22 -1.25,-5.68; 23 -0.75,-5.68; 24 -0.25,-5.68; 25 0.25,-5.68; 26 0.75,-5.68; 27 1.25,-5.68; 28 1.75,-5.68; 29 2.25,-5.68; 30 2.75,-5.68; 31 3.25,-5.68; 32 3.75,-5.68; 49 3.75,5.68; 50 3.25,5.68; 51 2.75,5.68; 52 2.25,5.68; 53 1.75,5.68; 54 1.25,5.68; 55 0.75,5.68; 56 0.25,5.68; 57 -0.25,5.68; 58 -0.75,5.68; 59 -1.25,5.68; 60 -1.75,5.68; 61 -2.25,5.68; 62 -2.75,5.68; 63 -3.25,5.68; 64 -3.75,5.68
SOT23-5 = smd 0.55 x 1.2: 1 -0.95,-1.3; 2 0,-1.3; 3 0.95,-1.3; 4 0.95,1.3; 5 -0.95,1.3
PVQFN-16 = smd 1.05 x 0.35: 1 -2.1,0.975; 2 -2.1,0.325; 3 -2.1,-0.325; 4 -2.1,-0.975; 9 2.1,-0.975; 10 2.1,-0.325; 11 2.1,0.325; 12 2.1,0.975 | smd 0.35 x 1.05: 5 -0.975,-2.1; 6 -0.325,-2.1; 7 0.325,-2.1; 8 0.975,-2.1; 13 0.975,2.1; 14 0.325,2.1; 15 -0.325,2.1; 16 -0.975,2.1 | drill 0.4: P$18 0,0; P$19 -0.9,0.9; P$20 0.9,0.9; P$21 0.9,-0.9; P$22 -0.9,-0.9 | smd 2.7 x 2.7: THERMAL 0,0
MOUNTINGHOLE_2.5_PLATED = drill 2.5 pad 3.2: P$1 0,0
RESCAXS50P200X100X45-8N = smd 0.79 x 0.39: 1 -0.62,0.8; 4 -0.62,-0.8; 5 0.62,-0.8; 8 0.62,0.8 | smd 0.79 x 0.29: 2 -0.62,0.25; 3 -0.62,-0.25; 6 0.62,-0.25; 7 0.62,0.25
CAPCAXE50P210X130X94-8N = smd 0.77 x 0.21: 1 -0.8,0.75; 2 -0.8,0.25; 3 -0.8,-0.25; 4 -0.8,-0.75; 5 0.8,-0.75; 6 0.8,-0.25; 7 0.8,0.25; 8 0.8,0.75
0628 = smd 1.6 x 6.3: P$1 -2.39,0; P$2 2.36,0
SOD123FL = smd 0.91 x 1.22: A 1.625,0; C -1.625,0
WROOM32_SKINNY = smd 1.2 x 0.9: 1 -8.5,5; 2 -8.5,3.73; 3 -8.5,2.46; 4 -8.5,1.19; 5 -8.5,-0.08; 6 -8.5,-1.35; 7 -8.5,-2.62; 8 -8.5,-3.89; 9 -8.5,-5.16; 10 -8.5,-6.43; 11 -8.5,-7.7; 12 -8.5,-8.97; 13 -8.5,-10.24; 14 -8.5,-11.51; 25 8.5,-11.51; 26 8.5,-10.24; 27 8.5,-8.97; 28 8.5,-7.7; 29 8.5,-6.43; 30 8.5,-5.16; 31 8.5,-3.89; 32 8.5,-2.62; 33 8.5,-1.35; 34 8.5,-0.08; 35 8.5,1.19; 36 8.5,2.46; 37 8.5,3.73; 38 8.5,5 | smd 0.9 x 1.2: 15 -5.7,-12.9; 16 -4.43,-12.9; 17 -3.16,-12.9; 18 -1.89,-12.9; 19 -0.62,-12.9; 20 0.65,-12.9; 21 1.92,-12.9; 22 3.19,-12.9; 23 4.46,-12.9; 24 5.73,-12.9 | smd 6 x 6: P$1 0.34,-2.7

### Placement (x,y rotation side)
2PIN  21.34,24.26 0 top
C1  22.29,8.84 270 top
C2  32.96,23.77 180 top
C3  26.67,22.99 270 top
C4  17.4,12.45 270 top
C5  18.95,6.03 270 bottom
C6  29.46,23.84 180 top
C7  24.01,9.5 270 top
C8  24.91,17.85 270 top
C9  21.01,28.57 90 bottom
C10  19.3,28.57 90 bottom
C11  27.37,6.03 270 bottom
C12  24,6.03 270 bottom
C13  17.61,28.57 90 bottom
C14  20.64,6.03 270 bottom
C15  22.29,6.03 270 bottom
C16  25.72,6.03 270 bottom
C17  48.39,30.67 90 bottom
C18  15.8,31.24 270 bottom
C19  14.5,35.46 0 bottom
C21  46.3,30.61 90 bottom
C22  23.09,29.18 90 bottom
C24  25.13,28.57 90 bottom
C25  15.56,6.03 90 bottom
CHG  12.7,9.14 270 top
D3  13.08,28.89 90 top
D4  20.32,17.14 180 top
FRAME2  0.19,0 0 top
IC1  27.43,11.43 0 top
J1  11.62,5.71 0 top
JP2  3.37,19.37 270 bottom
LED1  20.07,32.56 270 bottom
LED2  20.76,35.69 270 bottom
Q1  33.48,16.78 180 top
Q2  33.06,10.06 0 top
Q3  23.5,15.37 0 top
R1  33.15,20.7 180 top
R2  16.51,9.14 0 top
R3  33.15,22.25 0 top
R4  33.26,19.09 180 top
R5  27.56,29.08 0 bottom
R7  29.59,22.29 0 top
R9  24.38,35.69 180 bottom
R10  16.13,26.04 270 top
R11  24.45,32.54 180 bottom
R12  18.03,18.67 0 top
R16  50.48,30.61 270 bottom
R17  50.55,34.29 270 bottom
R18  35.31,34.29 90 bottom
R19  32.58,34.29 270 bottom
R20  17.26,6.03 90 bottom
SW2  19.68,11.18 270 top
T1  29.97,33.4 0 bottom
U1  21.08,19.24 180 bottom
U2  28.45,19.81 90 top
U3  28.45,16.51 270 top
U4  33.53,28.77 0 bottom
U$6  3.3,35.21 0 top
U$7  33.45,13.94 90 top
U$19  59.7,35.21 0 top
U$23  9.65,24.96 0 top
U$31  59.7,2.79 270 top
U$32  3.3,2.79 270 top
U$44  9.65,24.96 0 bottom
U$45  9.72,21.72 0 bottom
U$46  9.72,21.72 0 top
U$47  9.65,18.86 0 bottom
U$48  9.72,18.86 0 top
U$49  9.72,16 0 bottom
U$50  9.72,16 0 top
U$51  9.72,13.14 0 bottom
U$52  9.72,13.14 0 top
U$55  41.34,32.07 90 bottom
U$62  8.45,8.7 0 top
U$66  11.75,32.83 180 bottom
X2  48.9,16.38 270 top

### Tracks (layer width: path | path; a pad name or v marks a point on that pad's centre or on a via)
1_N
  Bottom 0.152: U$44.5 7.27,24.16 5.8,25.62 5.8,26.54 5.36,26.99 JP2.3
1_P
  Bottom 0.152: U$44.6 7.41,24.71 6.16,25.96 6.16,27.05 5.08,28.13 3.24,28.13 JP2.4
2_N
  Bottom 0.152: U$45.7 8.01,21.97 5.53,24.45 JP2.5
2_P
  Bottom 0.152: U$45.8 7.96,22.52 6.03,24.45 6.03,24.63 5.1,25.57 3.21,25.57 JP2.6
3.3V  (via drill 0.39)
  Top 0.203: C8.1 24.38,18.8 23.43,19.75 23.43,20.7 24.71,21.98 v25.34,21.98 25.34,21.14 26.59,19.89 26.59,19.42 U2.5 v28.38,18.86
  Top 0.254: IC1.5 IC1.6 | IC1.6 25.63,10.18 26.18,9.63 IC1.7 | IC1.6 24.61,10.18 24.59,10.16 24.2,10.16 C7.1
  Top 0.406: 24.91,18.91 C8.1 | C7.1 23.45,9.79 C1.1
  Route2 0.203: v28.38,18.86 30.73,18.86 33.91,22.04 v33.91,23.5
  Bottom 0.203: U1.48 25.92,14.65 24.59,14.65 24.39,14.45 24.39,14.29 | v28.57,6.92 28.56,6.93 C11.1 C16.1 26.1,7.31 26.1,10.96 24.39,12.68 24.39,13.51 U1.50 24.39,13.62 24.39,14.29 | U1.35 25.36,21.99 v25.34,21.98 | U1.52 23.33,14.39 23.59,14.64 23.66,14.64 23.69,14.67 24.05,14.67 24.28,14.45 24.28,14.4 24.39,14.29
  pour Top: -0.15,38.15 54.8,38.15 54.8,-0.19 -0.15,-0.19
3_N
  Bottom 0.152: U$45.5 6.65,20.92 5.66,21.91 JP2.7
3_P
  Bottom 0.152: U$45.6 6.6,21.47 5.84,22.23 5.84,22.67 5.46,23.05 3.24,23.05 JP2.8
4_N
  Bottom 0.152: JP2.9 6.02,19.37 6.03,19.38 6.05,19.38 6.34,19.08 9,19.08 U$47.7
4_P
  Bottom 0.152: JP2.10 3.21,20.48 5.44,20.48 6.49,19.43 7.81,19.43 8.03,19.66 U$47.8
5_N
  Bottom 0.152: JP2.11 7.19,16.83 8.42,18.06 U$47.5
5_P
  Bottom 0.152: JP2.12 3.21,17.95 5.73,17.95 6.49,17.18 7.04,17.18 8.47,18.61 U$47.6
5V  (via drill 0.39, 0.65)
  Top 0.61: U$62.C 6.82,6.31 v5.84,5.33
  Bottom 0.203: U1.21 U1.22 19.83,25.7 19.43,26.1 18.54,26.1 18.33,25.89 U1.19 18.33,23.29 v18.04,23 | U1.59 19.83,12.27 19.56,12 19.56,11.12 v19.43,10.99 | v28.48,5.87 25.25,5.87 24.19,6.93 C12.1 C15.1 22.33,6.98 U1.54 22.28,13.62 22.28,14.45 22.08,14.64 21.59,14.64 21.33,14.39 U1.56
  Bottom 0.61: U$66.C v8.38,32.83
  pour Route15: -0.93,38.91 -0.93,-1.14 54.61,-1.14 54.61,38.91
5VBAT
  Bottom 0.203: U4.1 35.63,30.35 35.11,30.87 U4.16 | U4.15 U4.16 | U4.16 36.77,33.13 36.77,34.35 35.93,35.19 R18.2 34.66,35.19 33.66,36.2 25.79,36.2 R9.2 23.59,34 18.25,34 16.89,35.35 15.8,35.35 | U$66.A 14.01,32.19 C18.1 15.9,32.3 C19.1
  Bottom 0.61: 15.8,35.35 C19.1
6_N
  Bottom 0.152: U$49.7 7.62,16.25 7.49,16.12 6.15,16.12 5.33,15.3 5.33,14.99 JP2.13
6_P
  Bottom 0.152: U$49.8 7.67,16.8 7.34,16.47 6,16.47 5.08,15.55 3.36,15.55 JP2.14
7_N
  Bottom 0.152: JP2.15 4.92,11.75 8.04,14.87 8.77,14.87 U$49.5
7_P
  Bottom 0.152: JP2.16 3.37,13.02 5.68,13.02 8.42,15.75 U$49.6
8_N
  Bottom 0.203: JP2.17 5.4,9.21 8.24,12.05 8.25,12.05 8.4,12.2 8.4,12.64 8.6,12.84 9.04,12.84 U$51.6
8_P
  Bottom 0.203: JP2.18 3.31,10.42 5.95,10.42 7.77,12.25 7.77,12.84 8.32,13.39 U$51.7
_SRB1  (via drill 0.39)
  Top 0.203: U$23.8 10.55,25.8 v13.79,25.8
  Bottom 0.203: U1.17 14.58,24.92 13.74,25.76 | v13.79,25.8 13.74,25.76 | 13.74,25.76 U$44.1
_SRB2  (via drill 0.39)
  Top 0.203: U$23.7 11.33,25.21 11.44,25.09 13.12,25.09 v13.21,25
  Bottom 0.203: U1.18 17.83,24.05 17.59,23.81 14.4,23.81 v13.21,25 13.01,25.21 U$44.2
A13_I35
  Top 0.254: X2.7 46.27,23.82 44.81,22.35 40.51,22.35 40.01,21.84 37.85,21.84 36.7,22.99 35.31,22.99 34.57,22.25 R3.2 R1.1
ADS_CS  (via drill 0.39)
  Top 0.203: v38.67,23.56 38.66,23.57 X2.13
  Bottom 0.203: U1.39 32.5,19.99 35.37,22.86 36.7,22.86 38.04,21.53 38.8,21.53 39.37,22.1 39.37,22.86 v38.67,23.56
ADS_RESET  (via drill 0.39)
  Top 0.203: v38.14,22.55 40.1,22.55 40.33,22.78 44.5,22.78 45.01,23.29 X2.8
  Bottom 0.203: U1.36 30.49,21.49 30.68,21.69 33.31,21.69 35.18,23.56 37.13,23.56 v38.14,22.55
ADS_START  (via drill 0.35)
  Top 0.152: X2.12 39.92,25.05 v38.77,26.21
  Route2 0.152: v30.2,25.76 30.18,25.74 24.83,25.74 v22.56,23.47
  Route15 0.152: v30.2,25.76 32.25,25.76 32.71,26.21 v38.77,26.21
  Bottom 0.152: U1.38 24.9,20.49 24.26,21.13 23.22,21.13 22.56,21.79 v22.56,23.47
BIAS
  Bottom 0.203: U$51.5 9.09,11.87 5.84,8.62 5.84,7.87 JP2.19 JP2.20
BIAS_DRV  (via drill 0.39)
  Top 0.203: v11.25,11.74 11.17,11.74 U$52.5
  Bottom 0.152: R20.1 C25.1
  Bottom 0.203: U$51.4 10.94,11.74 v11.25,11.74 12.14,11.74 14.3,9.58 14.3,6.39 C25.1
BIAS_IN
  Bottom 0.152: U1.63 17.83,7.5 R20.2 C25.2
  Bottom 0.203: U1.63 U1.62
CLK0  (via drill 0.39)
  Top 0.203: v37.3,16.68 36.35,15.73 X2.20
  Route15 0.203: v37.3,16.68 34.85,16.68 33.55,17.98 32.93,17.98 28.3,22.61 28.3,25.42 27.9,25.81 26.51,25.81 23.55,22.86 v23.55,21.84
  Bottom 0.203: U1.37 26.75,20.97 25.05,20.97 24.19,21.84 v23.55,21.84
D+  (via drill 0.39)
  Top 0.203: IC1.3 24.9,11.68 24.41,12.17 21.18,12.17 20.65,11.64 v20.27,11.64 | v12,7.58 11.62,7.2 J1.3
  Route15 0.203: v20.27,11.64 20.14,11.51 20.14,10.69 17.02,7.58 v12,7.58
D-  (via drill 0.39)
  Top 0.203: IC1.4 24.82,11.18 24.24,11.76 21.35,11.76 20.83,11.24 v20.83,10.18 | v10.67,7.24 10.97,6.94 J1.2
  Route2 0.203: v20.83,10.18 18.9,8.26 11.68,8.26 v10.67,7.24
DRDY  (via drill 0.39)
  Top 0.203: v37.53,11.94 37.51,11.92 X2.23
  Route15 0.203: v18.33,20.02 18.33,20.4 24.15,26.22 28.74,26.22 38.3,16.66 38.3,15.73 37.53,14.96 v37.53,11.94
  Bottom 0.203: v18.33,20.02 21.79,16.55 25.34,16.55 25.89,16.01 26.75,16.01 U1.47
DTR  (via drill 0.5)
  Top 0.203: 34.29,13.27 U$7.4
  Top 0.254: 34.29,13.27 v34.29,12.04 34.01,11.76 Q2.2 | IC1.23 26.68,14.24 v27.05,14.61
  Bottom 0.254: v27.05,14.61 27.3,14.86 30.1,14.86 31.37,13.59 33.78,13.59 34.29,13.08 v34.29,12.04
EN
  Top 0.203: U2.3 29.65,20.86 29.65,21.6 28.96,22.29 R7.1
ENABLE
  Bottom 0.203: U4.11 R5.1
GND  (via drill 0.3, 0.39, 0.4, 0.45, 0.5)
  Top 0.203: D3.C 12.03,30.07 v12.06,30.1 | X2.1 53.9,23.64 v53.91,23.62 | X2.38 53.9,6.71 v53.85,6.67 | 29.39,19.81 28.05,21.15 28.05,21.16 27.87,21.34 27.36,21.34 C3.2 27.37,22.04 27.75,22.42 27.75,23.1 28.48,23.84 C6.2 28.51,23.85 | 35.53,22.08 35.04,21.59 35.04,20.25 34.11,19.32 R4.1 | 35.53,22.08 35.55,22.1 | 35.98,22.1 X2.15 | 36.83,22.1 36.01,22.1 X2.15 | SW2.A' 20.6,13.34 v20.6,14.81 | R12.1 17.18,20.36 v17.91,21.08 | J1.5 12.92,6.58 v13.21,6.87 | 25.29,16.51 C8.2 24.7,16.9 v24.45,17.14 | C2.2 32.01,24.86 v31.86,25.01 | U$23.1 U$23.2 U$23.3 U$23.4 8.85,22.53 U$46.1 U$46.2 U$46.3 U$46.4 U$48.1 U$48.2 U$48.3 U$48.4 U$50.1 U$50.2 U$50.3 U$50.4 U$52.1 U$52.2 U$52.3 v7.07,12.89 v7.06,12.89 | X2.15 35.53,22.08 | X2.P$1 v46.35,15.88 | IC1.THERM v27.81,11.43 | SW2.A 21.05,9.13 C1.2 22.74,7.89
  Top 0.254: IC1.2 27.43,12.18 27.43,11.68 27.56,11.68 v27.81,11.43 | 36.83,22.1 37.59,21.34 39.31,21.34 v39.56,21.08 | 20.73,8.88 SW2.A | 17.4,11.43 C4.2 16.2,11.6 v16.18,11.62 | C2.2 32.3,23.48 R3.1 | U3.2 25.29,16.51 | U2.2 29.39,19.81 | C6.2 28.51,23.96 v29.08,24.54 | v25.15,9.14 24.65,8.65 C7.2 23.25,7.89 C1.2
  Top 0.305: 2PIN.1 20.34,17.52 v19.9,17.08
  Top 0.61: 2PIN.1 20.31,20.53
  Bottom 0.203: C11.2 C16.2 C12.2 C15.2 C14.2 C5.2 | C9.2 C10.2 C13.2 | 20.32,14.64 20.33,14.63 | 20.83,14.64 | U1.46 U1.45 U1.44 | U4.5 U4.7 | U4.THERMAL 33.2,28.44 U4.10 | U4.13 32.55,29.74 U4.P$20 | LED2.C v18.31,35.69
  Bottom 0.305: v19.9,17.08 19.9,15.66 20.6,14.96 v20.6,14.81
  other vias: 46.35,13.59 42.16,14.86 48.64,18.41 46.23,18.54 48.51,13.59 38.73,19.43 53.78,12.13 53.53,13.91 53.98,15.37 53.59,18.67 48.64,19.81 47.12,19.94 50.93,12.38 52.39,11.68 53.09,9.78 52.26,13.21 51.05,14.35 52.58,15.62 51.37,16.26 53.28,17.14 51.56,17.72 52.7,20.19 47.5,17.14 47.5,14.86 51.37,19.18 38.99,17.27 48.64,15.88 48.64,21.46 46.35,10.41 41.53,18.41 42.16,16.89
  pour Route2: -0.62,38.56 -0.62,-0.76 54.55,-0.76 54.55,38.56
  pour Bottom: -0.39,38.28 54.8,38.28 54.8,-0.44 -0.39,-0.44
GPIO0  (via drill 0.3)
  Top 0.203: v37.4,4.38 37.38,4.4 X2.25 | Q2.3 33.06,7.02 v33.03,7
  Route15 0.203: v37.4,4.38 35.65,4.38 v33.03,7
IN1_N  (via drill 0.39)
  Top 0.152: v11.43,23.94 10.72,23.94 U$23.5
  Bottom 0.152: v11.43,23.94 11.22,24.16 U$44.4
  Bottom 0.203: v11.43,23.94 12.19,23.94 13.62,22.52 15.4,22.52 U1.15
IN1_P  (via drill 0.39)
  Top 0.152: v13.78,23.46 12.64,24.6 10.56,24.6 U$23.6
  Bottom 0.152: v13.78,23.46 12.6,24.64 10.34,24.64 U$44.3
  Bottom 0.203: v13.78,23.46 14.25,22.99 14.41,22.99 14.42,22.99 U1.16
IN2_N  (via drill 0.39)
  Top 0.152: U$46.7 11.25,21.97 11.42,22.14 v12.01,22.14
  Bottom 0.152: U$45.2 11.17,21.97 11.35,22.14 v12.01,22.14
  Bottom 0.203: v12.01,22.14 12.84,22.14 13.28,21.7 13.84,21.7 14.04,21.5 14.21,21.5 14.22,21.5 14.69,21.5 14.7,21.5 15.39,21.5 U1.13
IN2_P  (via drill 0.39)
  Top 0.152: v11.37,22.92 10.91,22.47 U$46.8
  Bottom 0.152: U$45.1 10.74,22.92 v11.37,22.92
  Bottom 0.203: v11.37,22.92 12.64,22.92 13.45,22.11 14.18,22.11 14.32,21.97 15.38,21.97 U1.14
IN3_N  (via drill 0.39)
  Top 0.152: v12.3,20.59 12.29,20.59 12.23,20.53 11.12,20.53 10.68,20.97 U$46.5
  Bottom 0.152: v12.3,20.59 12.25,20.54 11.67,20.54 11.66,20.53 11.12,20.53 10.73,20.92 U$45.4
  Bottom 0.203: U1.11 13.87,20.49 13.82,20.54 12.36,20.54 v12.3,20.59
IN3_P  (via drill 0.39)
  Top 0.152: v11.52,21.18 11.23,21.47 U$46.6
  Bottom 0.152: v11.52,21.18 11.23,21.47 U$45.3
  Bottom 0.203: U1.12 13.64,20.99 13.34,21.29 11.63,21.29 v11.52,21.18
IN4_N  (via drill 0.39)
  Top 0.203: v13.11,19.36 13.06,19.31 11.76,19.31 11.56,19.11 U$48.7
  Bottom 0.152: U$47.2 10.33,19.05 11.56,19.05 11.86,19.36 v13.11,19.36
  Bottom 0.203: v13.11,19.36 13.19,19.43 15.35,19.43 U1.9
IN4_P  (via drill 0.39)
  Top 0.203: v11.3,19.88 11.04,19.61 U$48.8
  Bottom 0.152: U$47.1 11.09,19.66 v11.3,19.88
  Bottom 0.203: v11.3,19.88 12.57,19.88 12.71,20.01 15.38,20.01 U1.10
IN5_N  (via drill 0.39)
  Top 0.203: U$48.5 10.77,17.86 11.7,17.86 11.72,17.84 12.73,17.84 v12.75,17.86
  Bottom 0.203: U$47.4 10.46,17.87 12.74,17.87 v12.75,17.86 13.32,17.86 13.95,18.49 U1.7
IN5_P  (via drill 0.39)
  Top 0.203: v12.07,18.61 U$48.6
  Bottom 0.203: U$47.3 v12.07,18.61 13.49,18.61 13.82,18.93 15.35,18.93 U1.8
IN6_N  (via drill 0.39)
  Top 0.203: v12.7,16.35 12.65,16.3 10.57,16.3 U$50.7
  Bottom 0.203: U$49.2 12.6,16.25 v12.7,16.35 13.04,16.69 13.33,16.69 14.13,17.49 U1.5
IN6_P  (via drill 0.39)
  Top 0.203: v11.49,17.1 10.86,17.1 U$50.8
  Bottom 0.203: U$49.1 10.38,16.85 11.24,16.85 v11.49,17.1 13.16,17.1 14.05,17.99 U1.6
IN7_N  (via drill 0.39)
  Top 0.203: v11.4,14.83 10.99,15.25 U$50.5
  Bottom 0.203: U$49.4 11.04,15.2 v11.4,14.83 11.43,14.86 11.8,14.86 11.96,14.7 12.54,14.7 12.7,14.86 13.39,14.86 13.85,15.31 13.85,15.84 14.5,16.49 U1.3
IN7_P  (via drill 0.39)
  Top 0.203: U$50.6 11.91,15.75 v12.25,15.41
  Bottom 0.203: U$49.3 11.91,15.75 v12.25,15.41 12.81,15.41 14.39,16.99 U1.4
IN8_N  (via drill 0.39)
  Top 0.203: v12.4,12.87 12.38,12.89 U$52.6
  Bottom 0.203: U$51.3 12.38,12.89 v12.4,12.87 13.45,12.87 15.4,14.83 U1.1
IN8_P  (via drill 0.39)
  Top 0.203: v11.5,13.78 11.12,13.39 U$52.7
  Bottom 0.203: U$51.2 11.12,13.39 v11.5,13.78 13.34,13.78 14.27,14.72 14.27,15.69 14.57,15.99 U1.2
IO13_A12  (via drill 0.39)
  Top 0.254: R10.1 15.77,27.24 v14.99,27.24 | v37.34,20.07 36.58,20.83 36.01,20.83 X2.16
  Route2 0.254: v14.99,27.24 19.49,22.73 26.54,22.73 27.43,23.62 32.51,23.62 34.54,25.65 36.45,25.65 37.34,24.77 v37.34,20.07
LBO
  Bottom 0.203: T1.B 30.92,30.25 U4.12
MISO  (via drill 0.3, 0.39)
  Top 0.203: v45.02,6.67 44.94,6.75 44.94,7.82 X2.31
  Route15 0.152: v19.24,20.46 23,20.46 24.05,19.41 25.88,19.41 29.11,16.18
  Route15 0.203: 29.11,16.18 34.81,10.48 34.81,7.77 37.2,5.37 43.35,5.37 44.65,6.67 v45.02,6.67
  Bottom 0.152: v19.24,20.46 21.69,18.01 25.34,18.01
  Bottom 0.203: U1.43 26.75,18.01 25.34,18.01
MOSI  (via drill 0.39)
  Top 0.203: X2.30 43.69,7.84 v43.69,6.67
  Route15 0.203: v27.62,25.14 27.62,20.66 35.21,13.07 35.21,7.94 37.37,5.78 43.18,5.78 43.69,6.29 v43.69,6.67
  Bottom 0.203: U1.34 26.71,22.55 25.88,22.55 25.59,22.83 25.59,25.08 26.1,25.59 27.16,25.59 v27.62,25.14
N$1
  Top 0.254: R2.1 CHG.C
N$2  (via drill 0.35)
  Top 0.254: v31.11,11.79 v31.12,11.79 U$7.1 | v31.11,10.08 31.11,10.05 Q2.1
  Route2 0.254: v31.11,11.79 v31.11,10.08
N$3  (via drill 0.5)
  Top 0.254: v24.32,20.07 25.55,20.07 26.16,19.46 26.16,18.29 26.99,17.46 U3.1 | R2.2 17.36,10.01 v17.02,10.35
  Route2 0.254: v24.32,20.07 23.75,20.64 20.69,20.64 16.94,16.89 16.94,10.43 v17.02,10.35
N$4
  Top 0.254: U3.5 31.05,17.46 31.62,18.03 31.62,18.8 31.91,19.09 R4.2
N$5
  Top 0.254: R10.2 16,25.18 14.13,27.06 D3.A
N$6
  Top 0.254: U$7.5 34.24,15.65 34.43,15.83 Q1.1
N$7  (via drill 0.39, 0.45)
  Top 0.152: U2.1 29.76,18.87 30.3,18.87 | 30.99,19.63 30.99,19.56
  Top 0.203: C6.1 30.44,23.8 R7.2 30.44,21.5 v30.99,20.95 30.99,19.63 | 30.3,18.87 30.99,19.56
  Top 0.254: D4.C 21.3,17.14 v20.67,16.52
  Top 0.406: Q3.2 24.04,14.37 23.5,14.91 23.5,14.88 22.67,15.71 22.67,16.64 D4.C
  Route2 0.406: v20.67,16.52 23.36,19.21 25.11,19.21 26.86,20.95 v30.99,20.95
N$8
  Bottom 0.203: U1.30 23.85,24.94 23.85,26.24 25.13,27.52 C24.1
N$9
  Bottom 0.203: U1.28 22.83,27.53 C22.1
N$10
  Bottom 0.203: U1.24 20.82,24.94 20.82,25.82 19.3,27.33 C10.1 C13.1
N$11
  Bottom 0.152: U1.55 21.83,8.13 C14.1 C5.1
N$14
  Bottom 0.203: U1.26 21.83,25.97 21.07,26.73 21.07,27.61 C9.1
N$16
  Bottom 0.203: U4.4 U4.3 36.82,28.44 37.15,28.77 37.15,32.64 38.94,34.43 U$55.P$2
N$17  (via drill 0.39)
  Route15 0.203: v36.13,26.86 32.3,26.86 v31.43,27.73
  Bottom 0.203: 50.49,33.33 50.52,33.36 | 50.52,33.36 R17.2 | 50.52,33.36 48.48,33.36 48.13,33.02 39.43,33.02 37.59,31.18 37.59,27.75 36.7,26.86 v36.13,26.86 | U4.9 v31.43,27.73
  Bottom 0.61: R16.1 50.48,33.33 50.49,33.33
N$18
  Bottom 0.203: U4.14 33.2,31.29 R18.1 R19.2
N$19
  Bottom 0.203: R9.1 LED2.A
N$20
  Bottom 0.203: R11.1 21.14,32.54 LED1.A
N$21
  Bottom 0.203: R11.2 26.53,33.72 29.09,33.72 T1.C
RESET  (via drill 0.5)
  Top 0.203: U$7.7 33.2,15.39 Q1.3
  Top 0.254: X2.3 51.35,24.43 49.66,22.73 49.66,12.9 49.4,12.65 42.72,12.65 v40.13,15.24 | C4.1 18.82,13.3 SW2.B' 18.74,13.08 18.67,13.08 18.67,9.34 SW2.B 18.89,8.67 19.56,8 v20.57,8 | v33.48,16.73 Q1.3
  Route2 0.254: v20.57,8 23.75,8 24.26,7.49 27.43,7.49 27.81,7.87 27.81,9.02 26.92,9.91 26.92,13.46 26.29,14.1 26.29,14.99 26.67,15.37 30.61,15.37 31.88,14.1 32.51,14.1 | 32.51,14.1 36.7,14.1 37.72,15.11 40.01,15.11 v40.13,15.24 | 32.51,14.1 32.51,15.76 v33.48,16.73
RTS
  Top 0.254: IC1.19 29.06,13.43 29.29,13.21 31.3,13.21 U$7.8 32.16,15.04 32.16,17.41 Q1.2
RXD0  (via drill 0.39, 0.5)
  Top 0.254: IC1.21 27.68,14.14 28.4,14.86 30.48,14.86 30.73,15.11 30.73,16 v30.92,16.19 | X2.34 48.81,10.88 48.06,11.63 41.96,11.63 v41.4,12.19
  Bottom 0.254: v41.4,12.19 41.02,12.57 41.02,17.53 40.39,18.16 38.73,18.16 37.97,17.4 36.96,17.4 35.69,18.67 32.26,18.67 30.92,17.34 v30.92,16.19
SCK  (via drill 0.39)
  Top 0.203: v42.48,9.21 42.48,7.9 X2.29
  Bottom 0.203: U1.40 28.02,19.49 28.09,19.56 28.68,19.56 28.94,19.3 37.78,19.3 38.41,18.67 40.51,18.67 41.34,19.49 42.16,19.49 42.92,18.74 42.92,11.17 42.48,10.73 v42.48,9.21
SRB1
  Bottom 0.203: U$44.8 6.01,28.78 6.01,29.86 5.2,30.67 2.98,30.67 2.1,29.78 JP2.2
SRB2
  Bottom 0.203: U$44.7 8.49,25.22 8.17,25.54 8.17,26 JP2.1
TXD0  (via drill 0.5)
  Top 0.254: IC1.20 28.18,13.98 28.42,14.22 29.59,14.22 v29.78,14.03 | v38.35,13.53 41.08,13.53 42.44,12.17 48.41,12.17 50.09,10.49 X2.35
  Bottom 0.254: v38.35,13.53 38.04,13.53 37.97,13.46 37.34,13.46 35.13,11.25 33.91,11.25 33.22,11.94 31.88,11.94 v29.78,14.03
VBAT  (via drill 0.39)
  Top 0.203: 31.98,20.7 R1.2 | 27.66,15.56 U3.3
  Top 0.254: 22.23,21.21 22.48,20.95 | 31.98,20.7 31.45,20.17 31.45,19.32 31.11,18.99 31.11,18.54 30.71,18.14 29,18.14 28.51,17.65 28.51,16.41 27.66,15.56
  Top 0.406: 2PIN.2 22.48,20.7 | 22.48,20.7 22.48,20.95 | 22.23,21.84 22.23,21.21 | 22.48,20.7 22.48,19.11 23.5,18.1 Q3.3 23.5,16.11 24.05,15.56 U3.3
  Top 0.61: 22.23,21.84 23.24,22.86 25.33,22.86 26.41,23.94 C3.1 R5.2
  Route2 0.203: v38.67,28.13 36.58,26.04 34.39,26.04 34.01,25.65 32.96,25.65 v32.96,25.61 | v29.97,28.13 v29.97,30.42
  Bottom 0.203: U$55.P$1 39.79,28.13 v38.67,28.13 | v32.96,25.61 32.55,26.01 U4.8 30.8,26.67 29.97,27.5 v29.97,28.13 | v29.97,30.42 29.97,31.25 T1.E
  Bottom 0.61: R16.2 48.4,29.71 | 48.4,29.71 C17.1 | R5.2 26.66,31.36 27.5,32.2 T1.E | 48.4,29.71 C21.1 46.27,29.68 U$55.P$1
  other vias: 26.66,29.08
VBUS  (via drill 0.39, 0.5)
  Top 0.203: D4.A 11.65,10.32 CHG.A 10.52,9.14 U$62.A 10.07,7.91 9.65,7.49 9.65,6.92 10.32,6.25 J1.1
  Top 0.254: D4.A 18.88,17.56 | IC1.8 26.68,8.56 v26.98,8.26
  Top 0.406: Q3.1 22.55,14.41 21.84,15.11 v21.84,15.75 19.05,15.75 18.47,16.33 D4.A | v29.84,16.48 29.84,15.66 U3.4
  Top 0.61: 18.88,17.56 R12.2
  Route2 0.406: 23.24,13.72 24.11,13.72 24.49,14.1 24.49,15.47 25.02,16 29.37,16 v29.84,16.48 | 23.24,13.72 22.86,13.72 21.84,14.73 v21.84,15.75 | 23.24,13.72 23.24,9.78 24.77,8.26 v26.98,8.26

### Text on the board
tPlace: 1SRB2 | P1N | 12 | 27 | 33 | 15 | 32 | 14 | SCL | SDA | BAT | EN | USB | 13 | P2N | #13 | P3N | P4N | P5N | P6N | P7N | huzzah! | P8N | CHG | BIAS | A4 | A5 | SCK | MO | MI | RX | TX | 21
tNames: SleepSure / ADS1299 ESP32 / 12 Apr 2021 / Rev 3 | Ian Romano / Nate Joseph / Kyle Sapia / Matias Saavedra Silva